# Altium schematic sheet sch_master.SCHDOC: Auto Tracker Schematic
size A4; Author: Wang Chengxin; CompanyName: Core Dynamics; DrawnBy: Wang Chengxin; Engineer: Wang Chengxin; Revision: 1.0; SheetNumber: 1; CurrentDate: 2010-12-24
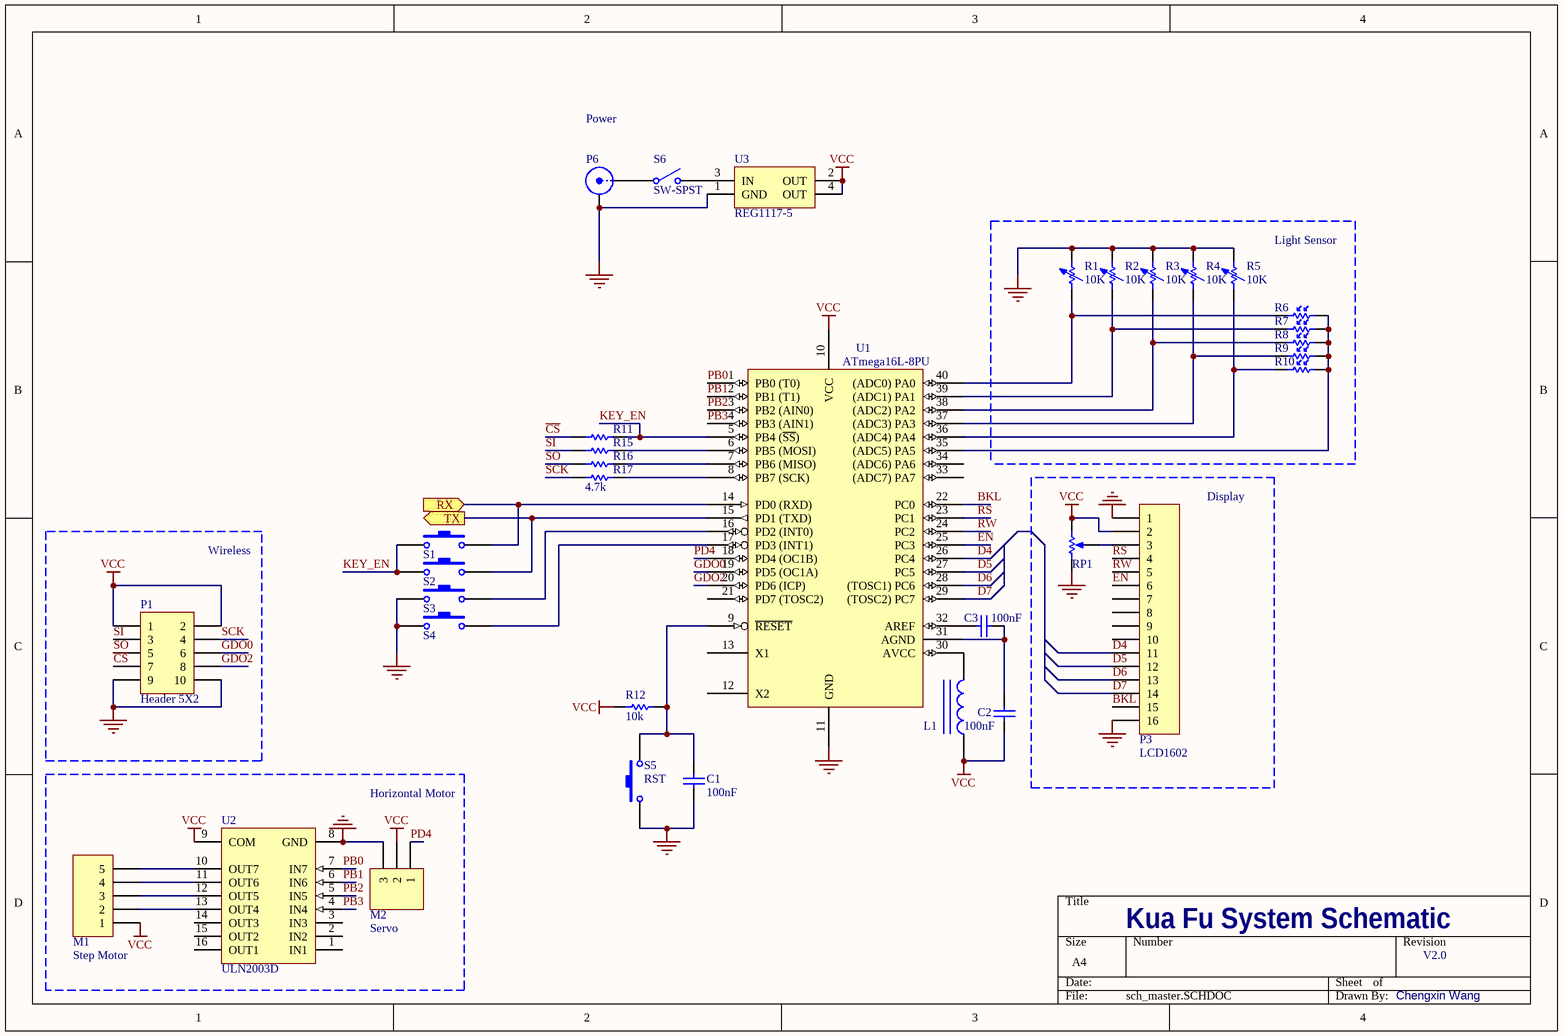
[diagram p0: sch_master.SCHDOC]

## Parts
C1  value 100nF  [RAD-0.3]  (hidden comment: Cap)
C2  value 100nF  [RAD-0.3]  (hidden comment: Cap)
C3  value 100nF  [RAD-0.3]  (hidden comment: Cap)
L1  Inductor Iron  [AXIAL-0.9]  (value not drawn)
M1  Step Motor  [HDR1X5]
M2  Servo  [HDR1X3]
P1  Header 5X2  [HDR2X5]
P3  LCD1602  [HDR1X16]
P6  SMB  [SMB_V-RJ45]  (value not drawn)
R1  10K  [AXIAL-0.7]
R2  10K  [AXIAL-0.7]
R3  10K  [AXIAL-0.7]
R4  10K  [AXIAL-0.7]
R5  10K  [AXIAL-0.7]
R6  Res Semi  [AXIAL-0.5]  (value not drawn)
R7  Res Semi  [AXIAL-0.5]  (value not drawn)
R8  Res Semi  [AXIAL-0.5]  (value not drawn)
R9  Res Semi  [AXIAL-0.5]  (value not drawn)
R10  Res Semi  [AXIAL-0.5]  (value not drawn)
R11  Res1  [AXIAL-0.3]  (value not drawn)
R12  value 10k  [AXIAL-0.3]  (hidden comment: Res1)
R15  Res1  [AXIAL-0.3]  (value not drawn)
R16  Res1  [AXIAL-0.3]  (value not drawn)
R17  value 4.7k  [AXIAL-0.3]  (hidden comment: Res1)
RP1  RPot  [VR5]  (value not drawn)
S1  SW-PB  [SPST-2]  (value not drawn)
S2  SW-PB  [SPST-2]  (value not drawn)
S3  SW-PB  [SPST-2]  (value not drawn)
S4  SW-PB  [SPST-2]  (value not drawn)
S5  RST  [SPST-2]
S6  SW-SPST  [SPST-2]
U1  ATmega16L-8PU  [DIP-40]
U2  ULN2003D  [SO16]
U3  REG1117-5  [ZZ311]

## Blocks framed on the sheet
Light Sensor: R1-R10
Display: P3 RP1
Wireless: P1
Horizontal Motor: M1 M2 U2

## Ports
RX (in), TX (out)

## Nets
GND: C1.1 M2.3 P1.9 P1.10 P3.1 P3.16 P6.2(Y) R1.2 R2.2 R3.2 R4.2 R5.2 RP1.1(TOP) S3.1 S4.1 S5.1 U1.11(GND) U2.8(GND) U3.1(GND)
VCC: C2.1 L1.1 M1.1 M2.2 P1.1 P1.2 P3.2 R12.1 RP1.2(BOT) U1.10(VCC) U2.9(COM) U3.2(OUT) U3.4(OUT)
BKL: P3.15 U1.22(PC0)
~{CS}: P1.7 R11.1
D4: P3.11 U1.26(PC4)
D5: P3.12 U1.27(PC5)
D6: P3.13 U1.28((TOSC1)_PC6)
D7: P3.14 U1.29((TOSC2)_PC7)
EN: P3.6 U1.25(PC3)
GDO0: P1.6 U1.19(PD5_(OC1A))
GDO2: P1.8 U1.20(PD6_(ICP))
KEY_EN: R11.2 S1.1 S2.1 U1.5(PB4_(~{SS}))
PB0: U1.1(PB0_(T0)) U2.7(IN7)
PB1: U1.2(PB1_(T1)) U2.6(IN6)
PB2: U1.3(PB2_(AIN0)) U2.5(IN5)
PB3: U1.4(PB3_(AIN1)) U2.4(IN4)
PD4: M2.1 U1.18(PD4_(OC1B))
RS: P3.4 U1.23(PC1)
RW: P3.5 U1.24(PC2)
RX: S1.2 U1.14(PD0_(RXD)) ; port RX
SCK: P1.4 R17.1
SI: P1.3 R15.1
SO: P1.5 R16.1
TX: S2.2 U1.15(PD1_(TXD)) ; port TX
NetC1_2: C1.2 R12.2 S5.2 U1.9(~{RESET})
NetC2_2: C2.2 C3.2 U1.31(AGND)
NetC3_1: C3.1 U1.32(AREF)
NetL1_2: L1.2 U1.30(AVCC)
NetM1_2: M1.2 U2.13(OUT4)
NetM1_3: M1.3 U2.12(OUT5)
NetM1_4: M1.4 U2.11(OUT6)
NetM1_5: M1.5 U2.10(OUT7)
NetP3_3: P3.3 RP1.3(TAP)
NetP6_1: P6.1(X) S6.1(COMMON)
NetR1_1: R1.1 R6.1 U1.40((ADC0)_PA0)
NetR2_1: R2.1 R7.1 U1.39((ADC1)_PA1)
NetR3_1: R3.1 R8.1 U1.38((ADC2)_PA2)
NetR4_1: R4.1 R9.1 U1.37((ADC3)_PA3)
NetR5_1: R5.1 R10.1 U1.36((ADC4)_PA4)
NetR6_2: R6.2 R7.2 R8.2 R9.2 R10.2 U1.35((ADC5)_PA5)
NetR15_2: R15.2 U1.6(PB5_(MOSI))
NetR16_2: R16.2 U1.7(PB6_(MISO))
NetR17_2: R17.2 U1.8(PB7_(SCK))
NetS3_2: S3.2 U1.16(PD2_(INT0))
NetS4_2: S4.2 U1.17(PD3_(INT1))
NetS6_2: S6.2(NO) U3.3(IN)

Not connected (* = marked no-connect by the designer): P3 7 8 9 10; U1 12(X2) 13(X1) 21(PD7_(TOSC2)) 33((ADC7)_PA7) 34((ADC6)_PA6); U2 1(IN1) 2(IN2) 3(IN3) 14(OUT3) 15(OUT2) 16(OUT1)

## Notes on the sheet
- Power
- Kua Fu System Schematic
- V2.0
- Chengxin Wang

## Library data of the parts
C1-C3 = Cap: Capacitor; Published: 8-Jun-2000; LatestRevisionDate: 17-Jul-2002; LatestRevisionNote: Re-released for DXP Platform.; Publisher: Altium Limited
L1 = Inductor Iron: Magnetic-Core Inductor; Value: 10uH; Published: 24-Mar-1999; LatestRevisionDate: 17-Jul-2002; LatestRevisionNote: Re-released for DXP Platform.; Publisher: Altium Limited
M1 = Header 5: Header, 5-Pin; LatestRevisionDate: 17-Jul-2002; LatestRevisionNote: Re-released for DXP Platform.; Publisher: Altium Limited
M2 = Header 3: Header, 3-Pin; LatestRevisionDate: 17-Jul-2002; LatestRevisionNote: Re-released for DXP Platform.; Publisher: Altium Limited
P1 = Header 5X2: Header, 5-Pin, Dual row; LatestRevisionDate: 17-Jul-2002; LatestRevisionNote: Re-released for DXP Platform.; Publisher: Altium Limited
P3 = Header 16: Header, 16-Pin; LatestRevisionDate: 17-Jul-2002; LatestRevisionNote: Re-released for DXP Platform.; Publisher: Altium Limited
P6 = SMB: SMB Straight Connector; LatestRevisionDate: 17-Jul-2002; LatestRevisionNote: Re-released for DXP Platform.; Publisher: Altium Limited
R1-R5 = Res Adj1: Variable Resistor; Set Position: 0.5; Published: 8-Jun-2000; LatestRevisionDate: 17-Jul-2002; LatestRevisionNote: Re-released for DXP Platform.; Publisher: Altium Limited; Value: 10K
R6-R10 = Res Semi: Semiconductor Resistor; Value: photoresistor; Published: 8-Jun-2000; LatestRevisionDate: 17-Jul-2002; LatestRevisionNote: Re-released for DXP Platform.; Publisher: Altium Limited
R11 R15 R16 = Res1: Resistor; Value: 4.7k; Published: 8-Jun-2000; LatestRevisionDate: 17-Jul-2002; LatestRevisionNote: Re-released for DXP Platform.; Publisher: Altium Limited
R12 R17 = Res1: Resistor; Published: 8-Jun-2000; LatestRevisionDate: 17-Jul-2002; LatestRevisionNote: Re-released for DXP Platform.; Publisher: Altium Limited
RP1 = RPot: Potentiometer; Sim Note: Enter the Resistance value and the set point into parameter fields.; Published: 8-Jun-2000; LatestRevisionDate: 17-Jul-2002; LatestRevisionNote: Re-released for DXP Platform.; Publisher: Altium Limited
S1-S5 = SW-PB: Switch; Published: 24-Mar-1999; LatestRevisionDate: 17-Jul-2002; LatestRevisionNote: Re-released for DXP Platform.; Publisher: Altium Limited
S6 = SW-SPST: Single-Pole, Single-Throw Switch; Published: 24-Mar-1999; LatestRevisionDate: 17-Jul-2002; LatestRevisionNote: Re-released for DXP Platform.; Publisher: Altium Limited
U1 = ATMEGA16_DIP40: Atmel Microcontroller - Library created by carel..  <www.mpfreezone.com>
U2 = ULN2003D: Seven Darlington Array; Published: 8-Jun-2000; LatestRevisionDate: 17-Jul-2002; LatestRevisionNote: Re-released for DXP Platform.; DatasheetDocument: Sep-1998; PackageDocument: May-1998; PackageReference: SO16; Publisher: Altium Limited
U3 = REG1117-5: 800mA and 1A Low Dropout Positive Regulator 2.85V, 3.3V, 5V, and Adjustable; PackageDocument: revC; Published: 8-Jun-2000; LatestRevisionDate: 17-Jul-2002; LatestRevisionNote: Re-released for DXP Platform.; DatasheetDocument: Sep-1997; PackageReference: ZZ311; Publisher: Altium Limited; ComponentLink1Description: Manufacturer Link; ComponentLink1URL: http://www.ti.com/